# EAGLE design LED rev3 (EAGLE 9.6.2)
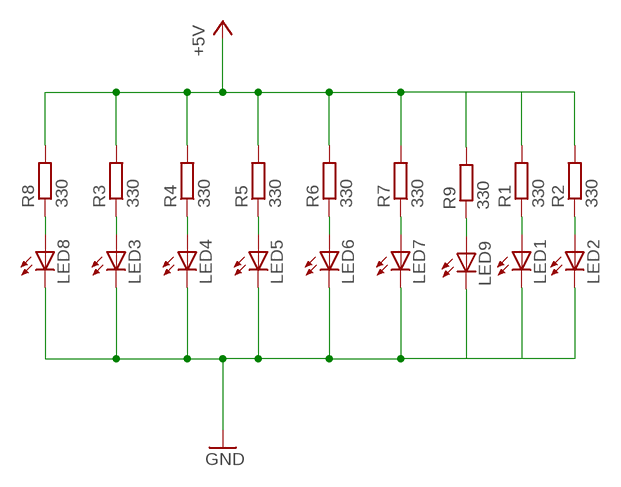
[diagram p0: schematic, sheet 1]

## Parts
LED1  LEDCHIPLED_0603  [CHIPLED_0603]
LED2  LEDCHIPLED_0603  [CHIPLED_0603]
LED3  LEDCHIPLED_0603  [CHIPLED_0603]
LED4  LEDCHIPLED_0603  [CHIPLED_0603]
LED5  LEDCHIPLED_0603  [CHIPLED_0603]
LED6  LEDCHIPLED_0603  [CHIPLED_0603]
LED7  LEDCHIPLED_0603  [CHIPLED_0603]
LED8  LEDCHIPLED_0603  [CHIPLED_0603]
LED9  LEDCHIPLED_0603  [CHIPLED_0603]
R1  330  R-EU_R0603  [R0603]
R2  330  R-EU_R0603  [R0603]
R3  330  R-EU_R0603  [R0603]
R4  330  R-EU_R0603  [R0603]
R5  330  R-EU_R0603  [R0603]
R6  330  R-EU_R0603  [R0603]
R7  330  R-EU_R0603  [R0603]
R8  330  R-EU_R0603  [R0603]
R9  330  R-EU_R0603  [R0603]

## Nets
+5V: R1.2 R2.2 R3.2 R4.2 R5.2 R6.2 R7.2 R8.2 R9.2
GND: LED1.C LED2.C LED3.C LED4.C LED5.C LED6.C LED7.C LED8.C LED9.C
N$1: LED8.A R8.1
N$2: LED7.A R7.1
N$3: LED3.A R3.1
N$4: LED4.A R4.1
N$5: LED5.A R5.1
N$6: LED6.A R6.1
N$7: LED9.A R9.1
N$8: LED1.A R1.1
N$9: LED2.A R2.1

## Library data of the parts
LED1-LED9 = led:LED: LED OSRAM: - CHIPLED LG R971, LG N971, LY N971, LG Q971, LY Q971, LO R971, LY R971 LH N974, LH R974 LS Q976, LO Q976, LY Q976 LO Q996 - Hyper CHIPLED LW Q18S LB Q993, LB Q99A, LB R99A - SideLED LS A670, LO A670, LY A670, LG A670, LP A670 LB A673, LV A673, LT A673, LW A673 LH A674 LY A675 LS A676, LA A676, LO A676, LY A676, LW A676 LS A679, LY A679, LG A679 - Hyper Micro SIDELED® LS Y876, LA Y876, LO Y876, LY Y876 LT Y87S - SmartLED LW L88C, LW L88S LB L89C, LB L89S, LG L890 LS L89K, LO L89K, LY L89K LS L896, LA L896, LO L896, LY L896 - TOPLED LS T670, LO T670, LY T670, LG T670, LP T670 LSG T670, LSP T670, LSY T670, LOP T670, LYG T670 LG T671, LOG T671, LSG T671 LB T673, LV T673, LT T673, LW T673 LH T674 LS T676, LA T676, LO T676, LY T676, LB T676, LH T676, LSB T676, LW T676 LB T67C, LV T67C, LT T67C, LS T67K, LO T67K, LY T67K, LW E67C LS E67B, LA E67B, LO E67B, LY E67B, LB E67C, LV E67C, LT E67C LW T67C LS T679, LY T679, LG T679 LS T770, LO T770, LY T770, LG T770, LP T770 LB T773, LV T773, LT T773, LW T773 LH T774 LS E675, LA E675, LY E675, LS T675 LS T776, LA T776, LO T776, LY T776, LB T776 LHGB T686 LT T68C, LB T68C - Hyper Mini TOPLED® LB M676 - Mini TOPLED Santana® LG M470 LS M47K, LO M47K, LY M47K Source: http://www.osram.convergy.de LUXEON: - LUMILED® LXK2-PW12-R00, LXK2-PW12-S00, LXK2-PW14-U00, LXK2-PW14-V00 LXK2-PM12-R00, LXK2-PM12-S00, LXK2-PM14-U00 LXK2-PE12-Q00, LXK2-PE12-R00, LXK2-PE12-S00, LXK2-PE14-T00, LXK2-PE14-U00 LXK2-PB12-K00, LXK2-PB12-L00, LXK2-PB12-M00, LXK2-PB14-N00, LXK2-PB14-P00, LXK2-PB14-Q00 LXK2-PR12-L00, LXK2-PR12-M00, LXK2-PR14-Q00, LXK2-PR14-R00 LXK2-PD12-Q00, LXK2-PD12-R00, LXK2-PD12-S00 LXK2-PH12-R00, LXK2-PH12-S00 LXK2-PL12-P00, LXK2-PL12-Q00, LXK2-PL12-R00 Source: www.luxeon.com KINGBRIGHT: KA-3528ASYC Source: www.kingbright.com
R1-R9 = rcl:R-EU_: RESISTOR, European symbol

## Board
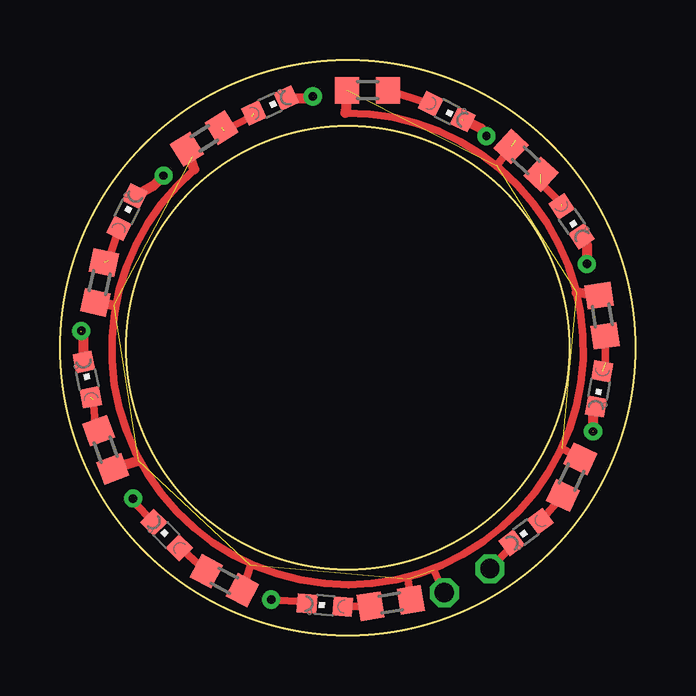
[diagram p1: board, top side]
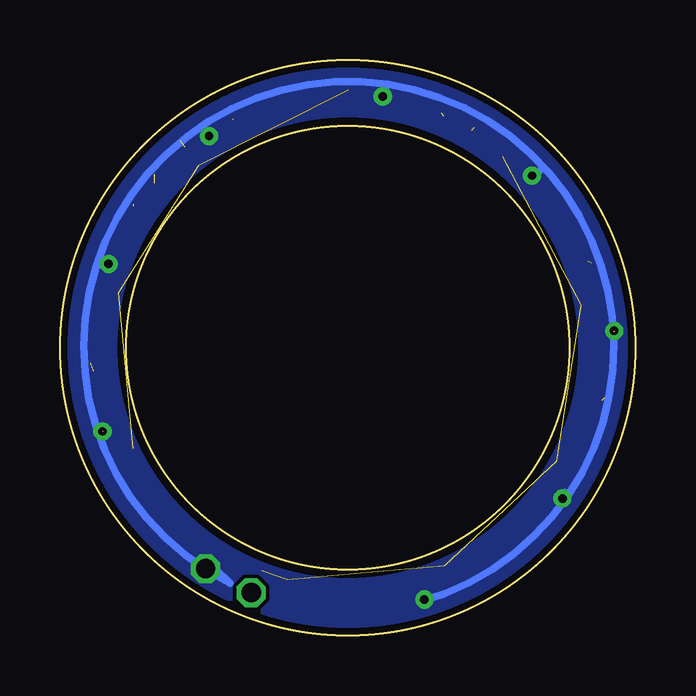
[diagram p2: board, bottom side, seen from below]

Size 24 x 24 mm. Coordinates in mm from the lower left corner, seen from the top.
Outline: circle at 12,12 radius 9.25
Outline: circle at 12,12 radius 12
Copper layers (1*16): Top 0.035mm / dielectric 1.5mm / Bottom 0.035mm
Design rules "default *": minimum track width 6mil, minimum drill 0.35mm, track to track 6mil, track to pad 6mil, pad to pad 6mil, via to via 6mil, smd to smd 6mil, copper to edge 0.3mm, drill to drill 0.2mm, minimum pad ring 10mil, minimum via ring 8mil, stop-mask expansion 4mil, vias tented up to drill 0mil, thermal gap 10mil

### Footprints (pad centres in the part's own frame; a part is rotated, then mirrored left to right if it is on the bottom)
CHIPLED_0603 = smd 0.8 x 0.8: A 0,-0.75; C 0,0.75
R0603 = smd 1 x 1.1: 1 -0.85,0; 2 0.85,0

### Placement (x,y rotation side)
LED1  11.05,1.27 85.6 top
LED2  4.45,4.19 45 top
LED3  1.14,10.67 11.3 top
LED4  2.79,17.65 333.5 top
LED5  8.76,22.1 294.9 top
LED6  16.13,21.84 243.9 top
LED7  21.34,17.27 213.8 top
LED8  22.48,10.29 169.8 top
LED9  19.43,4.32 126.8 top
R1  13.79,1.36 9.1 top
R2  6.86,2.29 332 top
R3  1.91,7.75 290.4 top
R4  1.66,14.73 257.9 top
R5  6.02,20.73 212 top
R6  12.83,22.73 180 top
R7  19.43,19.81 137.2 top
R8  22.61,13.34 98.5 top
R9  21.34,6.61 64.5 top

### Tracks (layer width: path | path; a pad name or v marks a point on that pad's centre or on a via)
+5V  (via drill 0.8)  (9 unrouted)
  Top 0.152: R8.2 22.53,14.28 | R5.2 5.53,19.97
  Top 0.305: 11.9,21.79 arc-320 5.6,19.43 | v16.02,1.79 16,1.81 15.6,2.72 | 18.98,20.63 18.23,19.59 | R9.2 20.94,7.8 | R1.2 14.52,2.35 | R2.2 7.94,2.93
  Top 0.406: R8.2 21.55,14.3 | R6.2 11.9,21.79 | R5.2 5.6,19.43 | 3.28,7.28 R3.2 | R4.2 2.25,13.78
GND  (via drill 0.35, 0.8)  (4 unrouted)
  Top 0.152: LED7.C | LED9.C 18.83,3.76
  Top 0.305: v3.05,5.72 3.05,5.59 LED2.C | LED1.C 10.23,1.4 v8.81,1.5 | LED9.C 18.83,3.69 v17.93,2.79
  Top 0.406: LED3.C 1,12.54 0.89,12.65 | v4.32,19.18 3.9,18.76 LED4.C | 10.56,22.49 10.48,22.41 LED5.C | v17.78,20.83 17.55,21.14 16.77,21.53 | v21.97,15.5 21.97,16.26 LED7.C | LED8.C 22.22,9.42 22.22,8.53
  Bottom 0.305: v4.32,19.18 4.01,19.37 | v10.54,22.48 10.42,22.79 | v17.78,20.83 17.78,20.9 18.05,21.23 | 22.43,15.5 21.98,15.5 v21.97,15.5 | v17.93,2.79 17.52,2.79 16.9,2.17 arc318 9.02,1.4 | v3.05,5.72 2.94,5.96 | v0.89,12.7 0.92,12.7 | 22.42,8.54 22.26,8.54 v22.23,8.51
  pour Bottom: 0.27,25.64 21.01,25.64 27.03,19.62 27.03,0.5 25.98,-0.55 23.35,-3.18 6.88,-3.18 5.24,-3.18 -3.64,5.7 -3.64,21.5 0.27,25.41
N$1  (1 unrouted)
  Top 0.305: R8.1 22.73,11.37
N$2  (2 unrouted)
  Top 0.305: 20.92,17.99 20.06,18.85
N$3  (1 unrouted)
  Top 0.152: R3.1 1.49,8.66
  Top 0.305: 1.39,9.83 1.49,8.66
N$4  (1 unrouted)
  Top 0.305: LED4.A 2,15.62
N$5  (2 unrouted)
  Top 0.305: 8,21.66 6.85,21.06
N$6
  Top 0.152: 15.38,22.17 LED6.A
  Top 0.305: 15.38,22.17 R6.1
N$7
  Top 0.305: R9.1 LED9.A
N$8
  Top 0.152: R1.1
  Top 0.305: R1.1 LED1.A
N$9
  Top 0.152: 5,3.66 LED2.A
  Top 0.305: R2.1 5,3.66